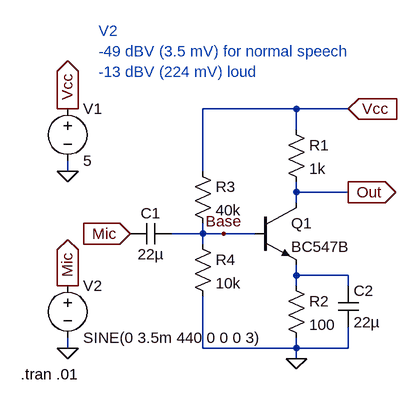
[diagram p0: schematic micamp.asc]
micamp.asc, the LTspice schematic file:
Version 4
SHEET 1 880 680
WIRE 48 -80 -96 -80
WIRE 128 -80 48 -80
WIRE 48 -48 48 -80
WIRE -304 16 -304 0
WIRE -96 16 -96 -80
WIRE 48 48 48 32
WIRE 128 48 48 48
WIRE 48 64 48 48
WIRE -96 112 -96 96
WIRE -96 112 -144 112
WIRE -64 112 -96 112
WIRE -16 112 -64 112
WIRE -96 128 -96 112
WIRE 48 176 48 160
WIRE 128 176 48 176
WIRE 48 192 48 176
WIRE 128 192 128 176
WIRE -304 288 -304 272
WIRE -96 288 -96 208
WIRE 48 288 48 272
WIRE 48 288 -96 288
WIRE 128 288 128 256
WIRE 128 288 48 288
WIRE 48 304 48 288
FLAG 48 304 0
FLAG -304 16 0
FLAG -304 288 0
FLAG 128 48 Out
IOPIN 128 48 Out
FLAG -208 112 Mic
IOPIN -208 112 In
FLAG -304 192 Mic
IOPIN -304 192 Out
FLAG -304 -80 Vcc
IOPIN -304 -80 Out
FLAG 128 -80 Vcc
IOPIN 128 -80 In
FLAG -64 112 Base
SYMBOL voltage -304 -96 R0
SYMATTR InstName V1
SYMATTR Value 5
SYMBOL voltage -304 176 R0
WINDOW 123 0 0 Left 2
WINDOW 39 0 0 Left 2
SYMATTR InstName V2
SYMATTR Value SINE(0 3.5m 440 0 0 0 3)
SYMBOL npn -16 64 R0
SYMATTR InstName Q1
SYMATTR Value BC547B
SYMBOL cap -144 96 R90
WINDOW 0 0 32 VBottom 2
WINDOW 3 32 32 VTop 2
SYMATTR InstName C1
SYMATTR Value 22µ
SYMBOL cap 112 192 R0
SYMATTR InstName C2
SYMATTR Value 22µ
SYMBOL res 32 -64 R0
SYMATTR InstName R1
SYMATTR Value 1k
SYMBOL res 32 176 R0
SYMATTR InstName R2
SYMATTR Value 100
SYMBOL res -112 0 R0
SYMATTR InstName R3
SYMATTR Value 40k
SYMBOL res -112 112 R0
SYMATTR InstName R4
SYMATTR Value 10k
TEXT -376 328 Left 2 !.tran .01
TEXT -256 -200 Left 2 ;V2\n-49 dBV (3.5 mV) for normal speech\n-13 dBV (224 mV) loud

The netlist it stands for:
* micamp.asc
V1 Vcc 0 5
V2 Mic 0 SINE(0 3.5m 440 0 0 0 3)
Q1 Out Base N001 0 BC547B
C1 Base Mic 22µ
C2 N001 0 22µ
R1 Vcc Out 1k
R2 N001 0 100
R3 Vcc Base 40k
R4 Base 0 10k
.model NPN NPN
.model PNP PNP
.lib standard.bjt
.tran .01
* V2
* -49 dBV (3.5 mV) for normal speech
* -13 dBV (224 mV) loud
.backanno
.end